# Altium project PMOD_CLP.PrjPcb
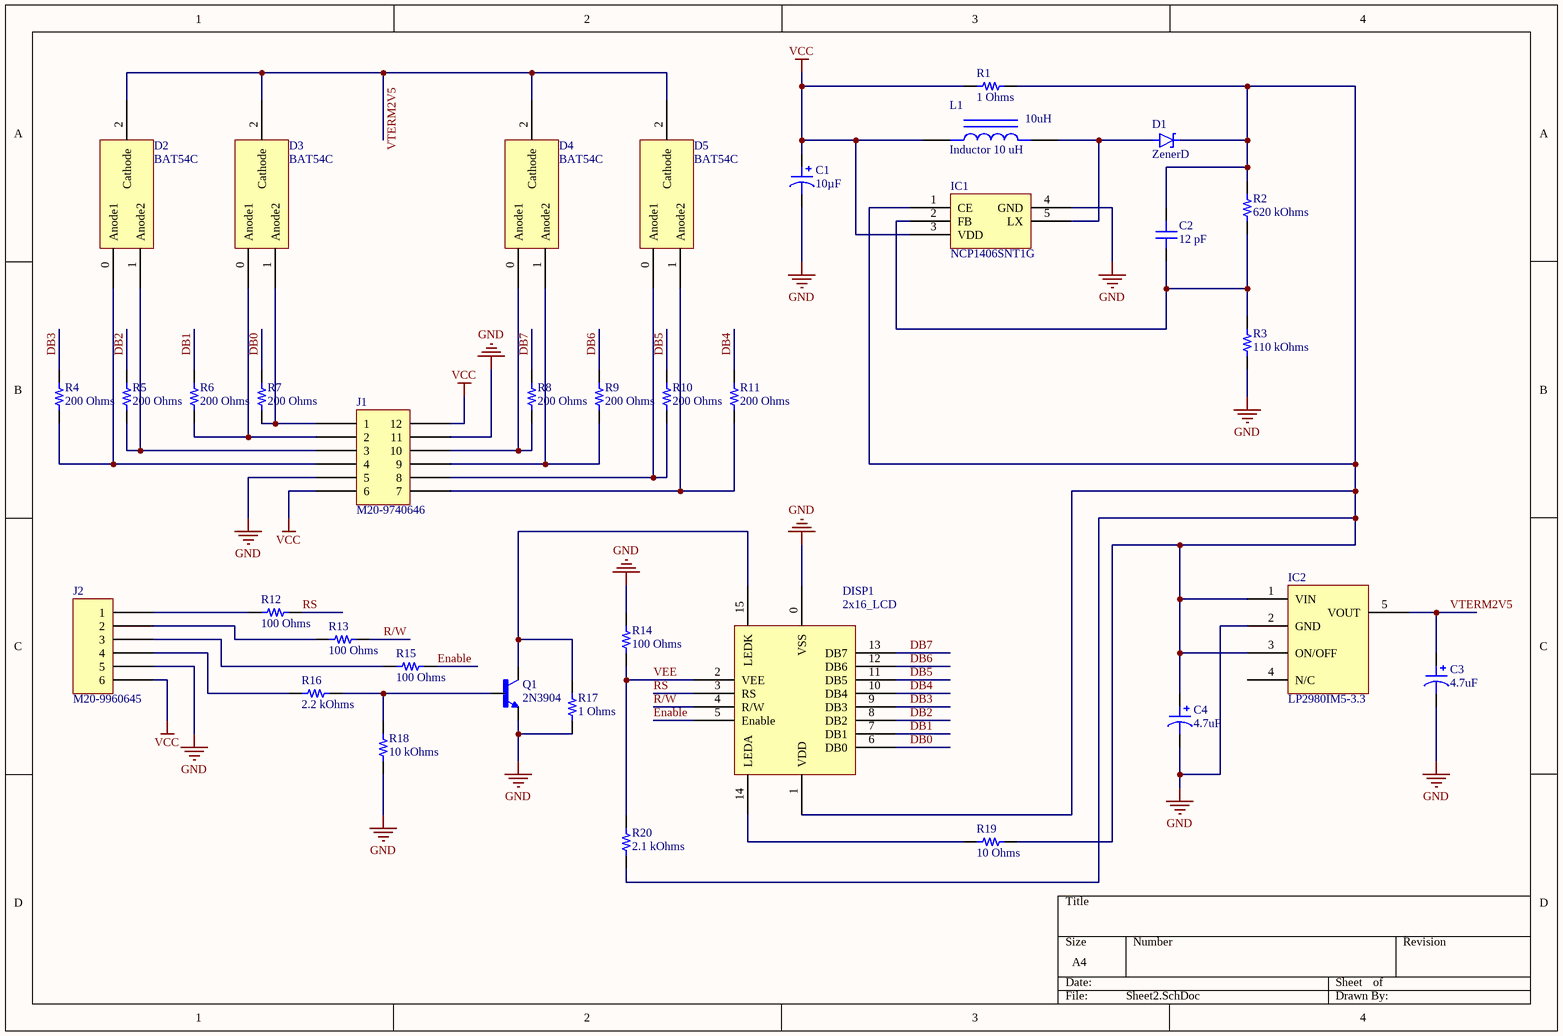
[diagram p0: Sheet2.SchDoc]
1 sheet, 36 parts. Net scope: global (net labels, ports and power ports of the same name join across sheets).
Board file: PCB2.PcbDoc

## Sheet Sheet2.SchDoc
size A4; SheetNumber: 1; SheetTotal: 1; SPICEModelCacheXTYOLSZU: <root> / <DocumentId>XTYOLSZU</DocumentId> / </root>

### Parts
C1  10µF  [CAP TH ALUM ELEC D5.00mm S2.00mm H11.00mm]
C2  12 pF  [CAP 0805_2012]
C3  4.7uF  [CAP TH ALUM ELEC D5.00mm S2.00mm H11.00mm]
C4  4.7uF  [CAP TH ALUM ELEC D5.00mm S2.00mm H11.00mm]
D1  ZenerD  [ZenerD]
D2  BAT54C  [BAT54C]
D3  BAT54C  [BAT54C]
D4  BAT54C  [BAT54C]
D5  BAT54C  [BAT54C]
DISP1  2x16_LCD  [2x16_LCD]
IC1  NCP1406SNT1G  [NCP1406SNT1G]
IC2  LP2980IM5-3.3  [LP2980IM5-3.3]
J1  M20-9740646  [HARWIN M20-9740645]
J2  M20-9960645  [HARWIN M20-9960645]
L1  Inductor 10 uH  [Inductor]
Q1  2N3904  [2N3904]
R1  1 Ohms  [RES 0805_2012]
R2  620 kOhms  [RES 0805_2012]
R3  110 kOhms  [RES 0805_2012]
R4  200 Ohms  [RES 0805_2012]
R5  200 Ohms  [RES 0805_2012]
R6  200 Ohms  [RES 0805_2012]
R7  200 Ohms  [RES 0805_2012]
R8  200 Ohms  [RES 0805_2012]
R9  200 Ohms  [RES 0805_2012]
R10  200 Ohms  [RES 0805_2012]
R11  200 Ohms  [RES 0805_2012]
R12  100 Ohms  [RES 0805_2012]
R13  100 Ohms  [RES 0805_2012]
R14  100 Ohms  [RES 0805_2012]
R15  100 Ohms  [RES 0805_2012]
R16  2.2 kOhms  [RES 0805_2012]
R17  1 Ohms  [RES 0805_2012]
R18  10 kOhms  [RES 0805_2012]
R19  10 Ohms  [RES 0805_2012]
R20  2.1 kOhms  [RES 0805_2012]

### Nets
GND: C1.2 C3.2 C4.2 DISP1.0(VSS) IC1.4(GND) IC2.2(GND) J1.5 J1.11 J2.5 Q1.1(E) R3.1 R14.1 R17.1 R18.1
VCC: C1.1 IC1.3(VDD) J1.6 J1.12 J2.6 L1.0 R1.2
DB0: DISP1.6(DB0) R7.1
DB1: DISP1.7(DB1) R6.2
DB2: DISP1.8(DB2) R5.1
DB3: DISP1.9(DB3) R4.1
DB4: DISP1.10(DB4) R11.1
DB5: DISP1.11(DB5) R10.1
DB6: DISP1.12(DB6) R9.1
DB7: DISP1.13(DB7) R8.1
Enable: DISP1.5(Enable) R15.2
R/W: DISP1.4(R/W) R13.2
RS: DISP1.3(RS) R12.2
VEE: DISP1.2(VEE) R14.2 R20.2
VTERM2V5: C3.1 D2.2(Cathode) D3.2(Cathode) D4.2(Cathode) D5.2(Cathode) IC2.5(VOUT)
NetC2_1: C2.1 IC1.2(FB) R2.1 R3.2
NetC2_2: C2.2 C4.1 D1.C DISP1.1(VDD) IC1.1(CE) IC2.1(VIN) IC2.3(ON/OFF) R1.1 R2.2 R19.2 R20.1
NetD1_A: D1.A IC1.5(LX) L1.1
NetD2_0: D2.0(Anode1) J1.4 R4.2
NetD2_1: D2.1(Anode2) J1.3 R5.2
NetD3_0: D3.0(Anode1) J1.2 R6.1
NetD3_1: D3.1(Anode2) J1.1 R7.2
NetD4_0: D4.0(Anode1) J1.10 R8.2
NetD4_1: D4.1(Anode2) J1.9 R9.2
NetD5_0: D5.0(Anode1) J1.8 R10.2
NetD5_1: D5.1(Anode2) J1.7 R11.2
NetDISP1_14: DISP1.14(LEDA) R19.1
NetDISP1_15: DISP1.15(LEDK) Q1.3(C) R17.2
NetJ2_1: J2.1 R12.1
NetJ2_2: J2.2 R13.1
NetJ2_3: J2.3 R15.1
NetJ2_4: J2.4 R16.1
NetQ1_2: Q1.2(B) R16.2 R18.2

Not connected (* = marked no-connect by the designer): IC2 4(N/C)

### Notes on the sheet
- (in symbol Inductor 2.2 uH) 10uH

### Library data of the parts
C1 = ECE-A1CN100U: CAP ALUM 10UF 20% 16V RADIAL; manufacturer: Panasonic Electronic Components; Lifetime @ Temp.: 2000 Hrs @ 85°C; Polarization: Bi-Polar; Ripple Current @ High Frequency: 68mA @ 10kHz; Ripple Current @ Low Frequency: 40mA @ 120Hz; Part Number: ECE-A1CN100U; Applications: General Purpose; Capacitance: 10µF; componentlink1description: Datasheet; componentlink1url: http://industrial.panasonic.com/www-cgi/jvcr13pz.cgi?E+PZ+3+ABA0097+ECEA1CN100U+7+WW; componentlink2description: DigiKey Link; componentlink2url: http://digikey.com/product-detail/en/panasonic-electronic-components/ECE-A1CN100U/P1163-ND/227604; Device Package: Radial, Can; Height - Seated (Max): 0.433" (11.00mm); lastupdated: 4.09.2020 23:28:57; Lead Spacing: 0.079" (2.00mm); Lifecycle Status: Active; Minimum Order: 1; Mounting Type: Through Hole; Operating Temperature: -40°C ~ 85°C; Package / Case: Radial, Can; packaging: Bulk; partid: 21486; Part Status: Active; price: 0.29; series: SU; Size / Dimension: 0.197" Dia (5.00mm); Supplier 1: DigiKey; Supplier Part Number 1: P1163-ND; Tolerance: ±20%; value: 10µF; Voltage - Rated: 16V
C2 = VJ0805A120FXJCW1BC: CAP CER 12PF 16V C0G/NP0 0805; manufacturer: Vishay Vitramon; Temperature Coefficient: C0G, NP0; Tolerance: ±1%; Part Number: VJ0805A120FXJCW1BC; Value: 12 pF; Applications: General Purpose; Capacitance: 12 pF; componentlink1description: Datasheet; componentlink1url: https://www.vishay.com/docs/28548/vjw1bcbascomseries.pdf; componentlink2description: DigiKey Link; componentlink2url: https://www.digikey.com/en/products/detail/vishay-vitramon/VJ0805A120FXJCW1BC/8307136; Device Package: 0805 (2012 Metric); lastupdated: 19.09.2022 13:03:27; Lifecycle Status: Active; Minimum Order: 1; Mounting Type: Surface Mount, MLCC; Operating Temperature: -55°C ~ 125°C; Package / Case: 0805 (2012 Metric); packaging: TapeAndReel; partid: 31670; Part Status: Active; price: 0.06; series: VJ; Size / Dimension: 0.079" L x 0.049" W (2.00mm x 1.25mm); Supplier 1: DigiKey; Supplier Part Number 1: 720-VJ0805A120FXJCW1BCCT-ND; Thickness (Max): 0.028" (0.70mm); Voltage - Rated: 16V
C3 C4 = ECE-A1CN100U: CAP ALUM 4.7UF 20% 16V RADIAL; manufacturer: Panasonic Electronic Components; Capacitance: 4.7µF; Lifetime @ Temp.: 2000 Hrs @ 85°C; Polarization: Bi-Polar; Ripple Current @ High Frequency: 68mA @ 10kHz; Ripple Current @ Low Frequency: 40mA @ 120Hz; value: 10µF; Part Number: ECE-A1CN100U; Applications: General Purpose; componentlink1description: Datasheet; componentlink1url: http://industrial.panasonic.com/www-cgi/jvcr13pz.cgi?E+PZ+3+ABA0097+ECEA1CN100U+7+WW; componentlink2description: DigiKey Link; componentlink2url: http://digikey.com/product-detail/en/panasonic-electronic-components/ECE-A1CN100U/P1163-ND/227604; Device Package: Radial, Can; Height - Seated (Max): 0.433" (11.00mm); lastupdated: 4.09.2020 23:28:57; Lead Spacing: 0.079" (2.00mm); Lifecycle Status: Active; Minimum Order: 1; Mounting Type: Through Hole; Operating Temperature: -40°C ~ 85°C; Package / Case: Radial, Can; packaging: Bulk; partid: 21486; Part Status: Active; price: 0.29; series: SU; Size / Dimension: 0.197" Dia (5.00mm); Supplier 1: DigiKey; Supplier Part Number 1: P1163-ND; Tolerance: ±20%; Voltage - Rated: 16V
J1 = M20-9740646: CONN HEADER R/A 12POS 2.54MM; Manufacturer: Harwin Inc.; Connector Type: Header, Cuttable; Current Rating (Amps): 3A per Contact; Material Flammability Rating: UL94 V-0; Number of Positions: 12; Number of Positions Loaded: All; Shrouding: Unshrouded; Style: Board to Board or Cable; Part Number: M20-9740646; ComponentLink1Description: Datasheet; ComponentLink1URL: https://cdn.harwin.com/pdfs/M20-974.pdf; ComponentLink2Description: DigiKey Link; ComponentLink2URL: http://digikey.com/product-detail/en/harwin-inc/M20-9740646/M20-9740646-ND/3920719; Contact Finish - Mating: Tin; Contact Finish - Post: Tin; Contact Material: Brass; Contact Shape: Square; Contact Type: Male Pin; Fastening Type: Push-Pull; Insulation Color: Black; Insulation Material: Polyamide (PA6T), Nylon 6T; LastUpdated: 21.09.2022 19:18:29; Lifecycle Status: Active; Minimum Order: 1500; Mounting Type: Through Hole, Right Angle; Number of Rows: 2; Operating Temperature: -40°C ~ 105°C; Packaging: Bulk; PartId: 159; Part Status: Active; Price: 0.27; Series: M20; Supplier 1: DigiKey; Supplier Part Number 1: M20-9740646-ND; Termination: Solder
J2 = M20-9960645: CONN HEADER R/A 6POS 2.54MM; Manufacturer: Harwin Inc.; Connector Type: Header, Cuttable; Contact Length - Mating: 0.240" (6.10mm); Contact Length - Post: 0.118" (3.00mm); Current Rating (Amps): 3A per Contact; Material Flammability Rating: UL94 V-0; Number of Positions: 6; Number of Positions Loaded: All; Pitch - Mating: 0.100" (2.54mm); Row Spacing - Mating: -40°C ~ 105°C; Shrouding: Unshrouded; Style: Board to Board or Cable; Part Number: M20-9960645; ComponentLink1Description: Datasheet; ComponentLink1URL: https://cdn.harwin.com/pdfs/Harwin_PC_Connectors_M20.pdf; ComponentLink2Description: DigiKey Link; ComponentLink2URL: https://www.digikey.com/en/products/detail/harwin-inc/M20-9960645/3728211; Contact Finish - Mating: Gold; Contact Material: Brass; Contact Shape: Square; Contact Type: Male Pin; Fastening Type: Push-Pull; Insulation Color: Black; Insulation Height: 0.100" (2.54mm); Insulation Material: Polyamide (PA6T), Nylon 6T; LastUpdated: 21.09.2022 19:23:50; Lifecycle Status: Active; Minimum Order: 1; Mounting Type: Through Hole, Right Angle; Number of Rows: 1; Operating Temperature: -40°C ~ 105°C; Packaging: Bulk; PartId: 169; Part Status: Active; Price: 0.16; Series: M20; Supplier 1: DigiKey; Supplier Part Number 1: 952-2247-ND; Termination: Solder
L1 = Inductor 2.2 uH
R1 R17 = SG73S2ATTD1R0J: RES 1 OHM 5% 1/4W 0805; Manufacturer: KOA Speer Electronics, Inc.; Power (Watts): 0.25W, 1/4W; Temperature Coefficient: ±200ppm/°C; Part Number: SG73S2ATTD1R0J; Value: 1 Ohms; ComponentLink1Description: Datasheet; ComponentLink1URL: http://www.koaspeer.com/catimages/Products/SG73S/SG73S.pdf; ComponentLink2Description: DigiKey Link; ComponentLink2URL: http://digikey.com/product-detail/en/koa-speer-electronics-inc/SG73S2ATTD1R0J/2019-SG73S2ATTD1R0JCT-ND/10280098; Composition: Thick Film; Device Package: 0805 (2012 Metric); Features: Automotive AEC-Q200, Moisture Resistant, Pulse Withstanding; Height - Seated (Max): 0.024" (0.60mm); LastUpdated: 19.09.2022 13:35:46; Lifecycle Status: Active; Minimum Order: 1; Number of Terminations: 2; Operating Temperature: -55°C ~ 155°C; Package / Case: 0805 (2012 Metric); Packaging: TapeAndReel; PartId: 46919; Part Status: Active; Price: 0.01; Ratings: AEC-Q200; Resistance: 1 Ohms; Series: SG73S; Size / Dimension: 0.079" L x 0.049" W (2.00mm x 1.25mm); Supplier 1: DigiKey; Supplier Part Number 1: 2019-SG73S2ATTD1R0JCT-ND; Supplier Device Package: 0805; Tolerance: ±5%
R2 = ERJ-PB6B6203V: RES SMD 620K OHM 0.1% 1/4W 0805; Manufacturer: Panasonic Electronic Components; Power (Watts): 0.25W, 1/4W; Temperature Coefficient: ±50ppm/°C; Part Number: ERJ-PB6B6203V; Value: 620 kOhms; ComponentLink1Description: Datasheet; ComponentLink1URL: https://industrial.panasonic.com/cdbs/www-data/pdf/RDM0000/AOA0000C328.pdf; ComponentLink2Description: DigiKey Link; ComponentLink2URL: https://www.digikey.com/en/products/detail/panasonic-electronic-components/ERJ-PB6B6203V/6213696; Composition: Thick Film; Device Package: 0805 (2012 Metric); Features: Automotive AEC-Q200, Pulse Withstanding; Height - Seated (Max): 0.028" (0.70mm); LastUpdated: 19.09.2022 13:36:02; Lifecycle Status: Active; Minimum Order: 1; Number of Terminations: 2; Operating Temperature: -55°C ~ 155°C; Package / Case: 0805 (2012 Metric); Packaging: TapeAndReel; PartId: 43356; Part Status: Active; Price: 0.04; Ratings: AEC-Q200; Resistance: 620 kOhms; Series: ERJ-PB6; Size / Dimension: 0.079" L x 0.049" W (2.00mm x 1.25mm); Supplier 1: DigiKey; Supplier Part Number 1: P20913CT-ND; Supplier Device Package: 0805; Tolerance: ±0.1%
R3 = RK73B2ATTD114J: RES 110K OHM 5% 1/4W 0805; Manufacturer: KOA Speer Electronics, Inc.; Power (Watts): 0.25W, 1/4W; Temperature Coefficient: ±200ppm/°C; Part Number: RK73B2ATTD114J; Value: 110 kOhms; ComponentLink1Description: Datasheet; ComponentLink1URL: https://www.koaspeer.com/pdfs/RK73B.pdf; ComponentLink2Description: DigiKey Link; ComponentLink2URL: https://www.digikey.com/en/products/detail/koa-speer-electronics-inc/RK73B2ATTD114J/10232127; Composition: Thick Film; Device Package: 0805 (2012 Metric); Features: Automotive AEC-Q200; Height - Seated (Max): 0.024" (0.60mm); LastUpdated: 19.09.2022 13:35:04; Lifecycle Status: Active; Minimum Order: 1; Number of Terminations: 2; Operating Temperature: -55°C ~ 155°C; Package / Case: 0805 (2012 Metric); Packaging: CutTape; PartId: 66501; Part Status: Active; Price: 0.01; Ratings: AEC-Q200; Resistance: 110 kOhms; Series: RK73B; Size / Dimension: 0.079" L x 0.049" W (2.00mm x 1.25mm); Supplier 1: DigiKey; Supplier Part Number 1: 2019-RK73B2ATTD114JCT-ND; Supplier Device Package: 0805; Tolerance: ±5%
R4-R11 = RK73B2ATTD201J: RES 200 OHM 5% 1/4W 0805; Manufacturer: KOA Speer Electronics, Inc.; Power (Watts): 0.25W, 1/4W; Temperature Coefficient: ±200ppm/°C; Part Number: RK73B2ATTD201J; Value: 200 Ohms; ComponentLink1Description: Datasheet; ComponentLink1URL: http://www.koaspeer.com/catimages/Products/RK73B/RK73B.pdf; ComponentLink2Description: DigiKey Link; ComponentLink2URL: https://www.digikey.com/en/products/detail/koa-speer-electronics-inc/RK73B2ATTD201J/10236213; Composition: Thick Film; Device Package: 0805 (2012 Metric); Features: Automotive AEC-Q200; Height - Seated (Max): 0.024" (0.60mm); LastUpdated: 19.09.2022 13:36:09; Lifecycle Status: Active; Minimum Order: 1; Number of Terminations: 2; Operating Temperature: -55°C ~ 155°C; Package / Case: 0805 (2012 Metric); Packaging: CutTape; PartId: 41280; Part Status: Active; Price: 0.01; Ratings: AEC-Q200; Resistance: 200 Ohms; Series: RK73B; Size / Dimension: 0.079" L x 0.049" W (2.00mm x 1.25mm); Supplier 1: DigiKey; Supplier Part Number 1: 2019-RK73B2ATTD201JCT-ND; Supplier Device Package: 0805; Tolerance: ±5%
R12-R15 = RK73B2ATTD101J: RES 100 OHM 5% 1/4W 0805; Manufacturer: KOA Speer Electronics, Inc.; Power (Watts): 0.25W, 1/4W; Temperature Coefficient: ±200ppm/°C; Part Number: RK73B2ATTD101J; Value: 100 Ohms; ComponentLink1Description: Datasheet; ComponentLink1URL: http://www.koaspeer.com/catimages/Products/RK73B/RK73B.pdf; ComponentLink2Description: DigiKey Link; ComponentLink2URL: https://www.digikey.com/en/products/detail/koa-speer-electronics-inc/RK73B2ATTD101J/10236510; Composition: Thick Film; Device Package: 0805 (2012 Metric); Features: Automotive AEC-Q200; Height - Seated (Max): 0.024" (0.60mm); LastUpdated: 19.09.2022 13:36:17; Lifecycle Status: Active; Minimum Order: 1; Number of Terminations: 2; Operating Temperature: -55°C ~ 155°C; Package / Case: 0805 (2012 Metric); Packaging: CutTape; PartId: 39368; Part Status: Active; Price: 0.01; Ratings: AEC-Q200; Resistance: 100 Ohms; Series: RK73B; Size / Dimension: 0.079" L x 0.049" W (2.00mm x 1.25mm); Supplier 1: DigiKey; Supplier Part Number 1: 2019-RK73B2ATTD101JCT-ND; Supplier Device Package: 0805; Tolerance: ±5%
R16 = RK73B2ATTD222J: RES 2.2K OHM 5% 1/4W 0805; Manufacturer: KOA Speer Electronics, Inc.; Power (Watts): 0.25W, 1/4W; Temperature Coefficient: ±200ppm/°C; Part Number: RK73B2ATTD222J; Value: 2.2 kOhms; ComponentLink1Description: Datasheet; ComponentLink1URL: http://www.koaspeer.com/catimages/Products/RK73B/RK73B.pdf; ComponentLink2Description: DigiKey Link; ComponentLink2URL: https://www.digikey.com/en/products/detail/koa-speer-electronics-inc/RK73B2ATTD222J/10236493; Composition: Thick Film; Device Package: 0805 (2012 Metric); Features: Automotive AEC-Q200; Height - Seated (Max): 0.024" (0.60mm); LastUpdated: 19.09.2022 13:36:01; Lifecycle Status: Active; Minimum Order: 1; Number of Terminations: 2; Operating Temperature: -55°C ~ 155°C; Package / Case: 0805 (2012 Metric); Packaging: CutTape; PartId: 43692; Part Status: Active; Price: 0.01; Ratings: AEC-Q200; Resistance: 2.2 kOhms; Series: RK73B; Size / Dimension: 0.079" L x 0.049" W (2.00mm x 1.25mm); Supplier 1: DigiKey; Supplier Part Number 1: 2019-RK73B2ATTD222JCT-ND; Supplier Device Package: 0805; Tolerance: ±5%
R18 = SG73S2ATTD1002F: RES 10K OHM 1% 1/4W 0805; Manufacturer: KOA Speer Electronics, Inc.; Power (Watts): 0.25W, 1/4W; Temperature Coefficient: ±200ppm/°C; Part Number: SG73S2ATTD1002F; Value: 10 kOhms; ComponentLink1Description: Datasheet; ComponentLink1URL: http://www.koaspeer.com/catimages/Products/SG73S/SG73S.pdf; ComponentLink2Description: DigiKey Link; ComponentLink2URL: https://www.digikey.com/en/products/detail/koa-speer-electronics-inc/SG73S2ATTD1002F/10279926; Composition: Thick Film; Device Package: 0805 (2012 Metric); Features: Automotive AEC-Q200, Moisture Resistant, Pulse Withstanding; Height - Seated (Max): 0.024" (0.60mm); LastUpdated: 19.09.2022 13:36:38; Lifecycle Status: Active; Minimum Order: 1; Number of Terminations: 2; Operating Temperature: -55°C ~ 155°C; Package / Case: 0805 (2012 Metric); Packaging: TapeAndReel; PartId: 33492; Part Status: Active; Price: 0.02; Ratings: AEC-Q200; Resistance: 10 kOhms; Series: SG73S; Size / Dimension: 0.079" L x 0.049" W (2.00mm x 1.25mm); Supplier 1: DigiKey; Supplier Part Number 1: 2019-SG73S2ATTD1002FCT-ND; Supplier Device Package: 0805; Tolerance: ±1%
R19 = RNCP0805FTD10R0: RES 10 OHM 1% 1/4W 0805; Manufacturer: Stackpole Electronics Inc; Power (Watts): 0.25W, 1/4W; Temperature Coefficient: ±100ppm/°C; Part Number: RNCP0805FTD10R0; Value: 10 Ohms; ComponentLink1Description: Datasheet; ComponentLink1URL: https://www.seielect.com/catalog/sei-rncp.pdf; ComponentLink2Description: DigiKey Link; ComponentLink2URL: https://www.digikey.com/en/products/detail/stackpole-electronics-inc/RNCP0805FTD10R0/2240197; Composition: Thin Film; Device Package: 0805 (2012 Metric); Features: Anti-Sulfur; Height - Seated (Max): 0.025" (0.65mm); LastUpdated: 19.09.2022 13:36:43; Lifecycle Status: Active; Minimum Order: 1; Number of Terminations: 2; Operating Temperature: -55°C ~ 155°C; Package / Case: 0805 (2012 Metric); Packaging: TapeAndReel; PartId: 32193; Part Status: Active; Price: 0.01; Resistance: 10 Ohms; Series: RNCP; Size / Dimension: 0.079" L x 0.049" W (2.00mm x 1.25mm); Supplier 1: DigiKey; Supplier Part Number 1: RNCP0805FTD10R0CT-ND; Supplier Device Package: 0805; Tolerance: ±1%
R20 = RK73H2ATTD2101F: RES 2.1K OHM 1% 1/4W 0805; Manufacturer: KOA Speer Electronics, Inc.; Power (Watts): 0.25W, 1/4W; Temperature Coefficient: ±100ppm/°C; Part Number: RK73H2ATTD2101F; Value: 2.1 kOhms; ComponentLink1Description: Datasheet; ComponentLink1URL: http://www.koaspeer.com/catimages/Products/RK73H/RK73H.pdf; ComponentLink2Description: DigiKey Link; ComponentLink2URL: https://www.digikey.com/en/products/detail/koa-speer-electronics-inc/RK73H2ATTD2101F/10234277; Composition: Thick Film; Device Package: 0805 (2012 Metric); Features: Automotive AEC-Q200, Moisture Resistant; Height - Seated (Max): 0.024" (0.60mm); LastUpdated: 19.09.2022 13:35:45; Lifecycle Status: Active; Minimum Order: 1; Number of Terminations: 2; Operating Temperature: -55°C ~ 155°C; Package / Case: 0805 (2012 Metric); Packaging: CutTape; PartId: 47004; Part Status: Active; Price: 0.01; Ratings: AEC-Q200; Resistance: 2.1 kOhms; Series: RK73H; Size / Dimension: 0.079" L x 0.049" W (2.00mm x 1.25mm); Supplier 1: DigiKey; Supplier Part Number 1: 2019-RK73H2ATTD2101FCT-ND; Supplier Device Package: 0805; Tolerance: ±1%